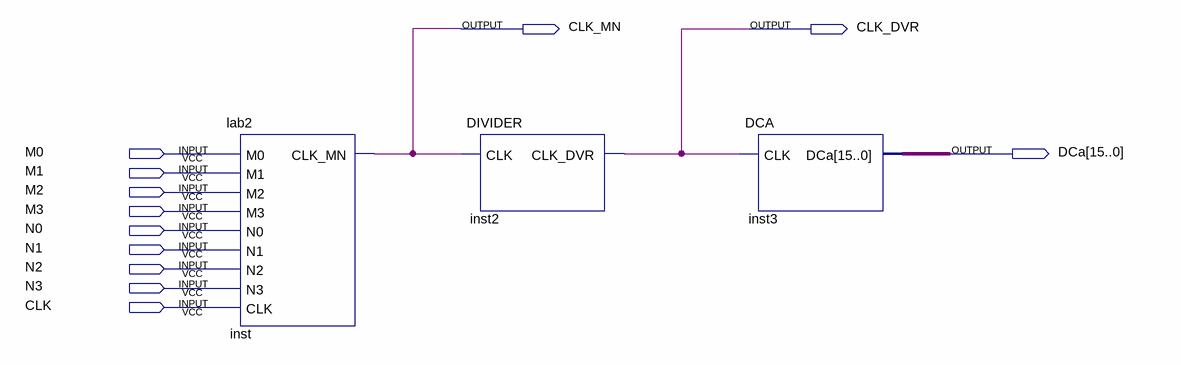
[diagram p0: schematic sheet]
// Quartus schematic FINAL.bdf as structural Verilog: 3 symbols, 12 pins
module FINAL (
  input  M0,
  input  M1,
  input  M2,
  input  M3,
  input  N0,
  input  N1,
  input  N2,
  input  N3,
  input  CLK,
  output CLK_MN,
  output CLK_DVR,
  output [15:0] DCa
);

  lab2 inst (.M0(M0), .M1(M1), .M2(M2), .M3(M3), .N0(N0), .N1(N1), .N2(N2), .N3(N3), .CLK(CLK), .CLK_MN(CLK_MN));
  DIVIDER inst2 (.CLK(CLK_MN), .CLK_DVR(CLK_DVR));
  DCA inst3 (.CLK(CLK_DVR), .DCa(DCa));
endmodule
